# EAGLE design nrfled (EAGLE 6.4)
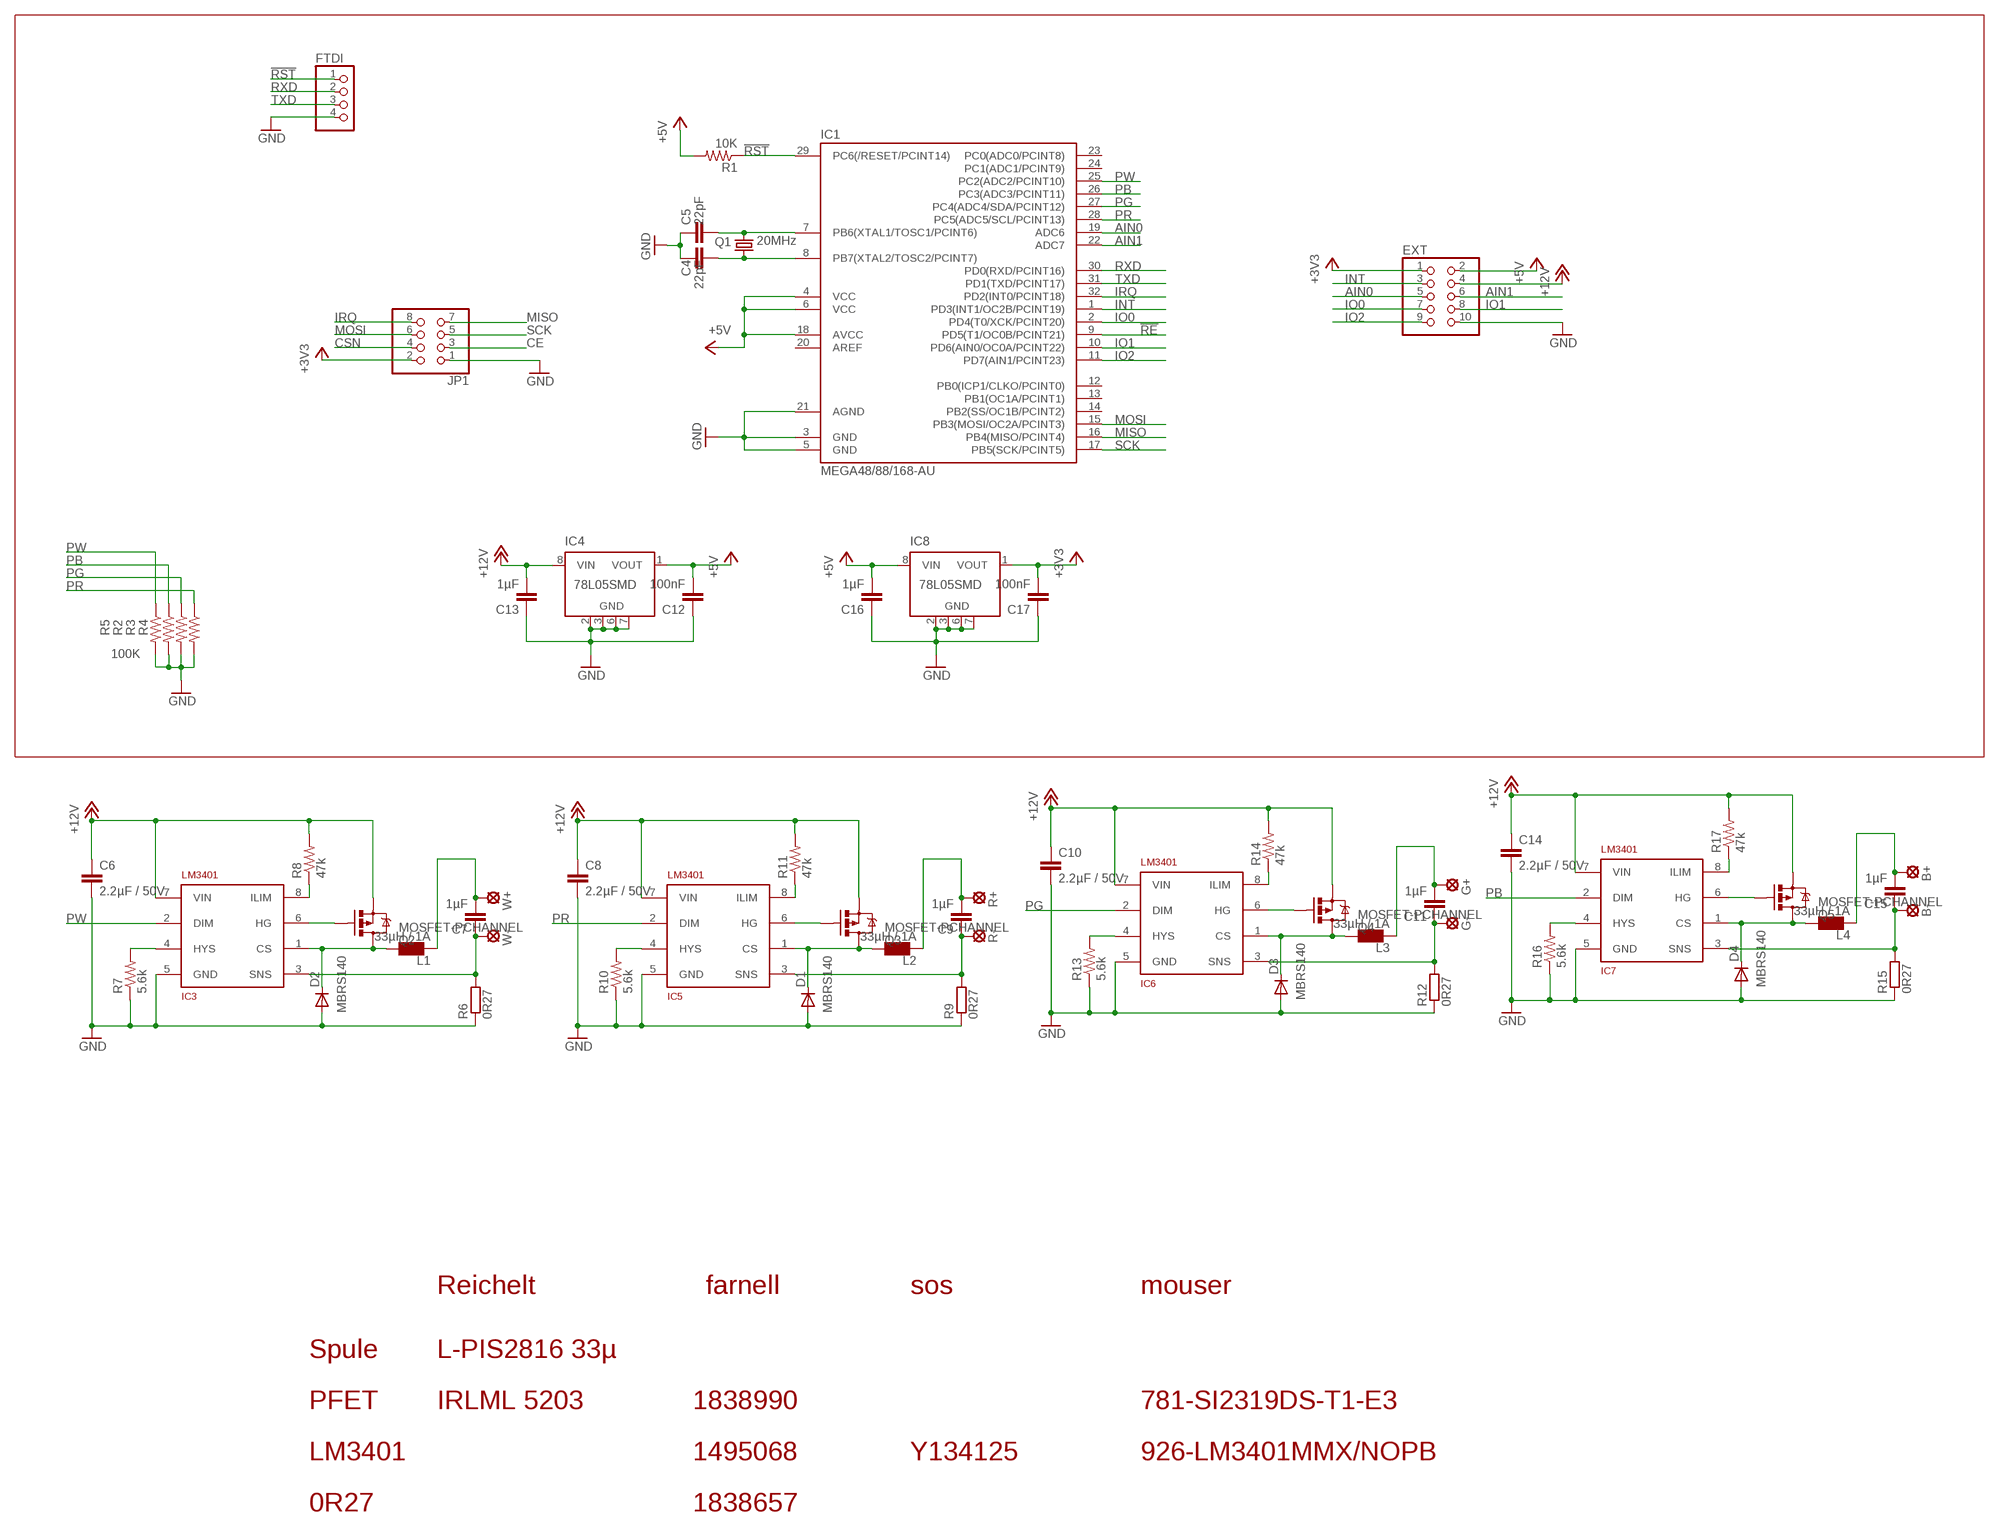
[diagram p0: schematic, sheet 1]

## Parts
B+  SE14  [SE14]
B-  SE14  [SE14]
C4  22pF  CAP0402-CAP  [0402-CAP]
C5  22pF  CAP0402-CAP  [0402-CAP]
C6  2.2µF / 50V  C-EUC1210  [C1210]
C7  1µF  CAP0805  [0805]
C8  2.2µF / 50V  C-EUC1210  [C1210]
C9  1µF  CAP0805  [0805]
C10  2.2µF / 50V  C-EUC1210  [C1210]
C11  1µF  CAP0805  [0805]
C12  100nF  CAP0402-CAP  [0402-CAP]
C13  1µF  CAP0805  [0805]
C14  2.2µF / 50V  C-EUC1210  [C1210]
C15  1µF  CAP0805  [0805]
C16  1µF  CAP0805  [0805]
C17  100nF  CAP0402-CAP  [0402-CAP]
D1  MBRS140  DIODE-SMB  [SMB]
D2  MBRS140  DIODE-SMB  [SMB]
D3  MBRS140  DIODE-SMB  [SMB]
D4  MBRS140  DIODE-SMB  [SMB]
EXT  PINHD-2X5  [2X05]
FTDI  PINHD-1X4  [1X04]
G+  SE14  [SE14]
G-  SE14  [SE14]
IC1  MEGA48/88/168-AU  [TQFP32-08]
IC3  LM3401  [MSOP8]
IC4  78L05SMD  [SO08]
IC5  LM3401  [MSOP8]
IC6  LM3401  [MSOP8]
IC7  LM3401  [MSOP8]
IC8  78L05SMD  [SO08]
JP1  PINHD-2X4  [2X04]
L1  33µH / 1A  L_PIS2816  [PIS2816]
L2  33µH / 1A  L_PIS2816  [PIS2816]
L3  33µH / 1A  L_PIS2816  [PIS2816]
L4  33µH / 1A  L_PIS2816  [PIS2816]
Q1  20MHz  X22-OSCILLATOR  [X22]
Q2  MOSFET-PCHANNEL  [SOT23]
Q3  MOSFET-PCHANNEL  [SOT23]
Q4  MOSFET-PCHANNEL  [SOT23]
Q5  MOSFET-PCHANNEL  [SOT23]
R1  10K  RESISTOR0402-RES  [0402-RES]
R2  100K  RESISTOR0402-RES  [0402-RES]
R3  100K  RESISTOR0402-RES  [0402-RES]
R4  100K  RESISTOR0402-RES  [0402-RES]
R5  100K  RESISTOR0402-RES  [0402-RES]
R6  0R27  R-EU_R1206  [R1206]
R7  5.6k  RESISTOR0805-RES  [0805]
R8  47k  RESISTOR0805-RES  [0805]
R9  0R27  R-EU_R1206  [R1206]
R10  5.6k  RESISTOR0805-RES  [0805]
R11  47k  RESISTOR0805-RES  [0805]
R12  0R27  R-EU_R1206  [R1206]
R13  5.6k  RESISTOR0805-RES  [0805]
R14  47k  RESISTOR0805-RES  [0805]
R15  0R27  R-EU_R1206  [R1206]
R16  5.6k  RESISTOR0805-RES  [0805]
R17  47k  RESISTOR0805-RES  [0805]
R+  SE14  [SE14]
R-  SE14  [SE14]
W+  SE14  [SE14]
W-  SE14  [SE14]

## Nets
!RE: IC1.9(PD5(T1/OC0B/PCINT21))
!RST: FTDI.1 IC1.29(PC6(/RESET/PCINT14)) R1.1
+3V3: C17.2 EXT.1 IC8.1(VOUT) JP1.2
+5V: C12.2 C16.2 EXT.2 IC1.4(VCC) IC1.6(VCC) IC1.18(AVCC) IC4.1(VOUT) IC8.8(VIN) R1.2
+12V: C6.1 C8.1 C10.1 C13.2 C14.1 EXT.4 IC3.7(VIN) IC4.8(VIN) IC5.7(VIN) IC6.7(VIN) IC7.7(VIN) Q2.2(S) Q3.2(S) Q4.2(S) Q5.2(S) R8.2 R11.2 R14.2 R17.2
AIN0: EXT.5 IC1.19(ADC6)
AIN1: EXT.6 IC1.22(ADC7)
CE: JP1.3
CSN: JP1.4
GND: C4.1 C5.1 C6.2 C8.2 C10.2 C12.1 C13.1 C14.2 C16.1 C17.1 D1.A D2.A D3.A D4.A EXT.10 FTDI.4 IC1.3(GND) IC1.5(GND) IC1.21(AGND) IC3.5(GND) IC4.2(GND) IC4.3(GND) IC4.6(GND) IC4.7(GND) IC5.5(GND) IC6.5(GND) IC7.5(GND) IC8.2(GND) IC8.3(GND) IC8.6(GND) IC8.7(GND) JP1.1 R2.2 R3.2 R4.2 R5.2 R6.1 R7.1 R9.1 R10.1 R12.1 R13.1 R15.1 R16.1
INT: EXT.3 IC1.1(PD3(INT1/OC2B/PCINT19))
IO0: EXT.7 IC1.2(PD4(T0/XCK/PCINT20))
IO1: EXT.8 IC1.10(PD6(AIN0/OC0A/PCINT22))
IO2: EXT.9 IC1.11(PD7(AIN1/PCINT23))
IRQ: IC1.32(PD2(INT0/PCINT18)) JP1.8
MISO: IC1.16(PB4(MISO/PCINT4)) JP1.7
MOSI: IC1.15(PB3(MOSI/OC2A/PCINT3)) JP1.6
N$1: C7.1 IC3.3(SNS) R6.2 W-.MP
N$2: C7.2 L1.P$2 W+.MP
N$3: D2.C IC3.1(CS) L1.P$1 Q2.3(D)
N$4: C9.1 IC5.3(SNS) R9.2 R-.MP
N$5: IC3.4(HYS) R7.2
N$6: C9.2 L2.P$2 R+.MP
N$7: IC3.8(ILIM) R8.1
N$8: D1.C IC5.1(CS) L2.P$1 Q3.3(D)
N$9: IC5.4(HYS) R10.2
N$10: IC3.6(HG) Q2.1(G)
N$11: IC5.8(ILIM) R11.1
N$12: IC5.6(HG) Q3.1(G)
N$13: C11.1 G-.MP IC6.3(SNS) R12.2
N$14: C11.2 G+.MP L3.P$2
N$15: D3.C IC6.1(CS) L3.P$1 Q4.3(D)
N$16: IC6.4(HYS) R13.2
N$17: IC6.8(ILIM) R14.1
N$20: IC6.6(HG) Q4.1(G)
N$21: B-.MP C15.1 IC7.3(SNS) R15.2
N$22: B+.MP C15.2 L4.P$2
N$23: D4.C IC7.1(CS) L4.P$1 Q5.3(D)
N$24: IC7.4(HYS) R16.2
N$25: IC7.8(ILIM) R17.1
N$26: IC7.6(HG) Q5.1(G)
PB: IC1.26(PC3(ADC3/PCINT11)) IC7.2(DIM) R2.1
PG: IC1.27(PC4(ADC4/SDA/PCINT12)) IC6.2(DIM) R3.1
PR: IC1.28(PC5(ADC5/SCL/PCINT13)) IC5.2(DIM) R4.1
PW: IC1.25(PC2(ADC2/PCINT10)) IC3.2(DIM) R5.1
RXD: FTDI.2 IC1.30(PD0(RXD/PCINT16))
SCK: IC1.17(PB5(SCK/PCINT5)) JP1.5
TXD: FTDI.3 IC1.31(PD1(TXD/PCINT17))
XTAL1: C5.2 IC1.7(PB6(XTAL1/TOSC1/PCINT6)) Q1.3
XTAL2: C4.2 IC1.8(PB7(XTAL2/TOSC2/PCINT7)) Q1.1
Unconnected: IC1.12(PB0(ICP1/CLKO/PCINT0)) IC1.13(PB1(OC1A/PCINT1)) IC1.14(PB2(SS/OC1B/PCINT2)) IC1.20(AREF) IC1.23(PC0(ADC0/PCINT8)) IC1.24(PC1(ADC1/PCINT9)) IC4.4(NC) IC4.5(NC) IC8.4(NC) IC8.5(NC)

## Notes on the sheet
- Reichelt | farnell | sos | mouser
- Spule | L-PIS2816 33µ
- PFET | IRLML 5203 | 1838990 | 781-SI2319DS-T1-E3
- LM3401 | 1495068 | Y134125 | 926-LM3401MMX/NOPB
- 0R27 | 1838657

## Library data of the parts
B+ B- G+ G- R+ R- W+ W- = solpad:SE14: SOLDER PAD E1553, drill 1,4mm, distributor Buerklin, 07F820
C4 C5 C7 C9 C11-C13 C15-C17 = SparkFun:CAP: Capacitor Standard 0603 ceramic capacitor, and 0.1" leaded capacitor.
C6 C8 C10 C14 = rcl:C-EU: CAPACITOR, European symbol
D1-D4 = diode:DIODE-: DIODE
EXT = pinhead:PINHD-2X5: PIN HEADER
FTDI = pinhead:PINHD-1X4: PIN HEADER
IC1 = avr-7:MEGA48/88/168
IC3 IC5-IC7 = seb:LM3401
IC4 IC8 = linear:78L*SMD: Positive VOLTAGE REGULATOR
JP1 = pinhead:PINHD-2X4: PIN HEADER
L1-L4 = seb:L_PIS2816
Q1 = seb:X22-OSCILLATOR
Q2-Q5 = SparkFun:MOSFET-PCHANNEL
R1-R5 R7 R8 R10 R11 R13 R14 R16 R17 = SparkFun:RESISTOR: Resistor Basic schematic elements and footprints for 0603, 1206, and PTH resistors.
R6 R9 R12 R15 = rcl:R-EU_: RESISTOR, European symbol

## Net classes
2 GND/3V3: width 0.2 mm, drill 0.4 mm

## Board
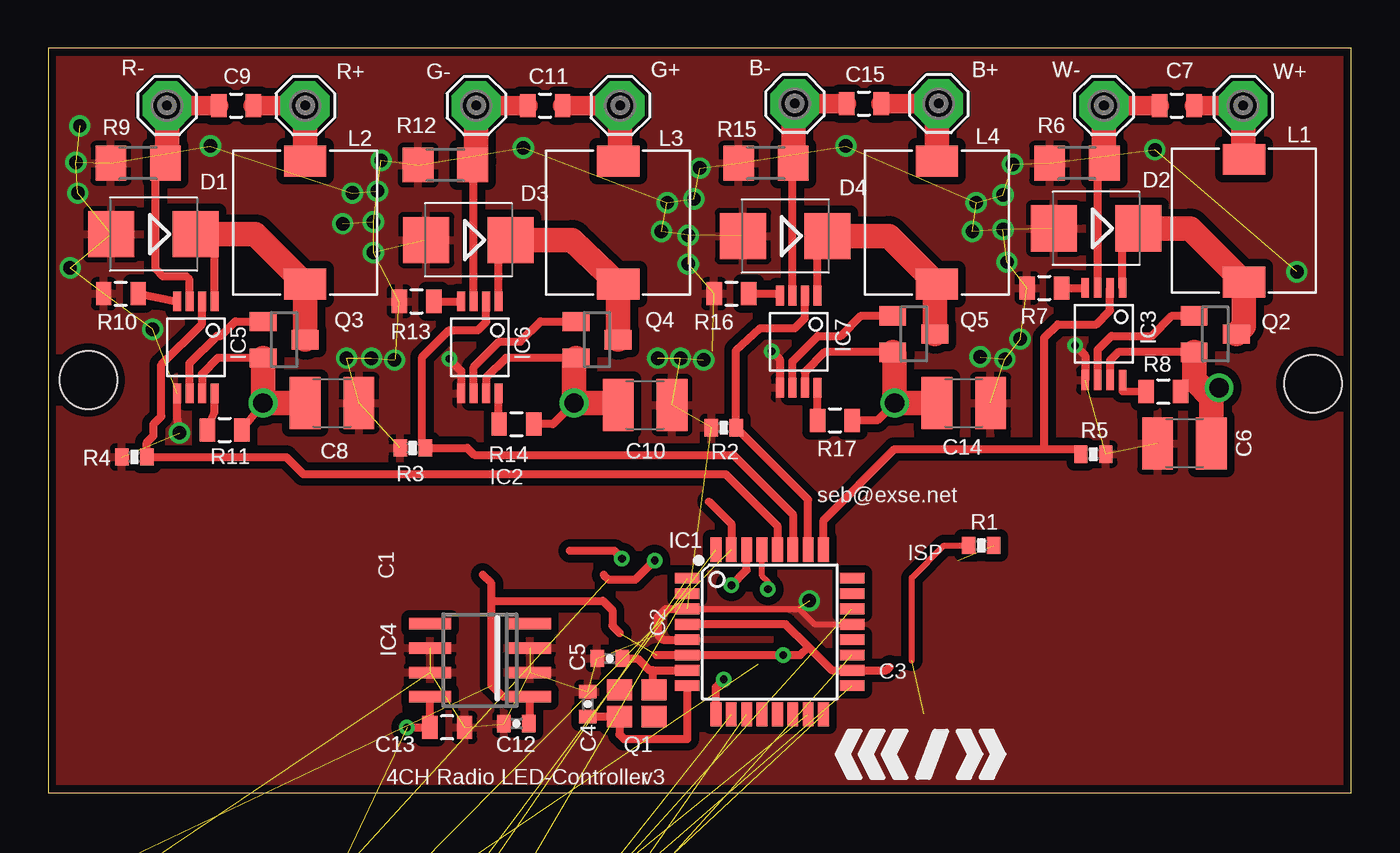
[diagram p1: board, top side]
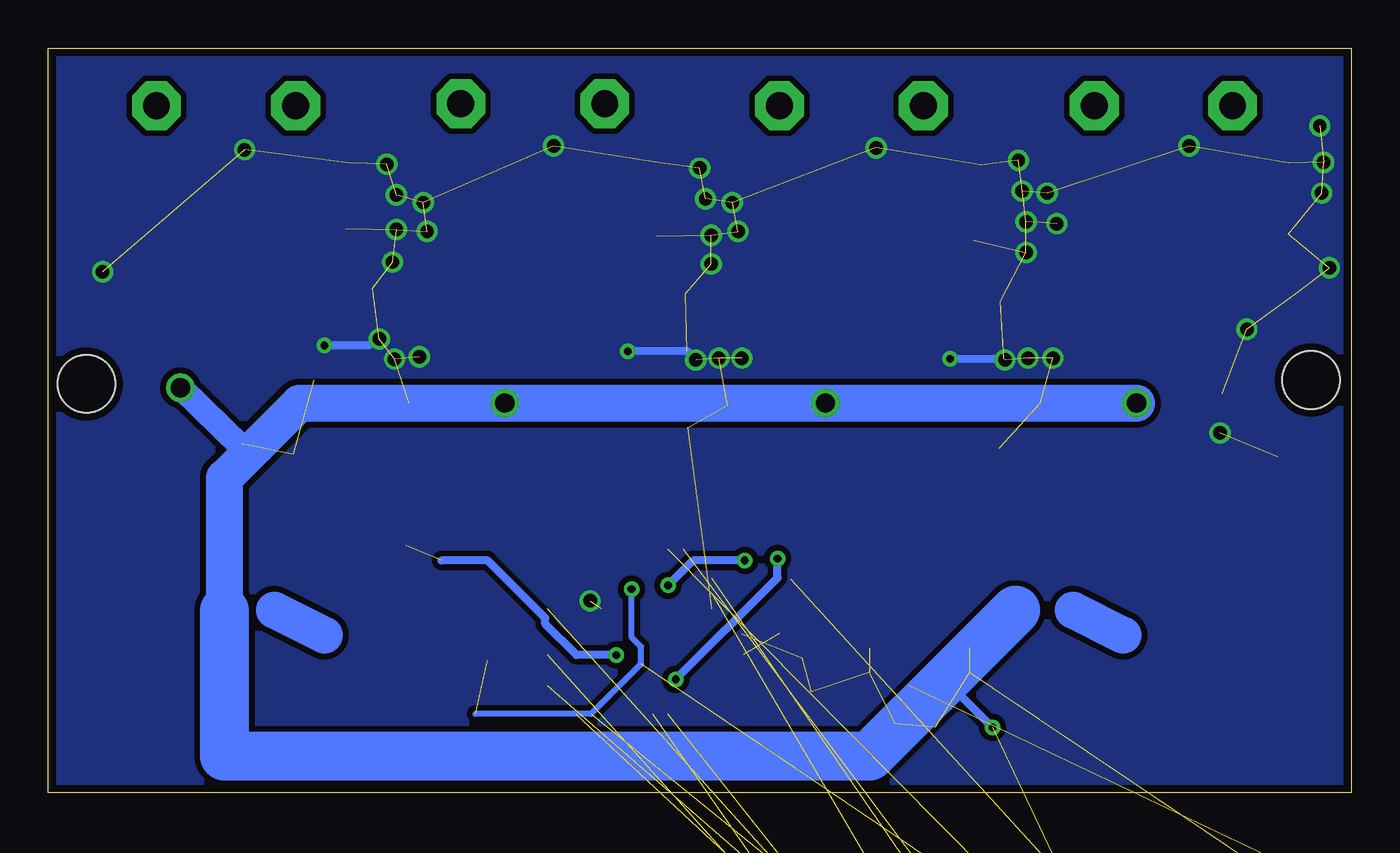
[diagram p2: board, bottom side, seen from below]

Size 67.9 x 38.8 mm. Coordinates in mm from the lower left corner, seen from the top.
Outline: 0,0 67.9,0 67.9,38.8 0,38.8 0,0
Copper layers (1*16): Top 0.035mm / dielectric 1.5mm / Bottom 0.035mm
Design rules "default *": minimum track width 0.2mm, minimum drill 0.5mm, track to track 0.2mm, track to pad 0.2mm, pad to pad 0.2mm, via to via 0.2mm, smd to smd 0mil, copper to edge 0.4mm, drill to drill 8mil, minimum pad ring 0.3mm, minimum via ring 8mil, stop-mask expansion 4mil, vias tented up to drill 40mil, thermal gap 10mil
Holes 3 mm at 2.1,21.5 65.9,21.3

### Footprints (pad centres in the part's own frame; a part is rotated, then mirrored left to right if it is on the bottom)
SE14 = drill 1.397 pad 2.54 octagon: MP 0,0
0402-CAP = smd 0.7 x 0.9: 1 -0.65,0; 2 0.65,0
C1210 = smd 1.6 x 2.7: 1 -1.4,0; 2 1.4,0
0805 = smd 0.8 x 1.2: 1 -0.9,0; 2 0.9,0
SMB = smd 2.4 x 2.4: A 2.2,0; C -2.2,0
2X05 = drill 1.016 octagon: 1 -5.08,-1.27; 2 -5.08,1.27; 3 -2.54,-1.27; 4 -2.54,1.27; 5 0,-1.27; 6 0,1.27; 7 2.54,-1.27; 8 2.54,1.27; 9 5.08,-1.27; 10 5.08,1.27
1X04 = drill 1.016 long: 1 -3.81,0; 2 -1.27,0; 3 1.27,0; 4 3.81,0
TQFP32-08 = smd 1.27 x 0.559: 1 -4.293,2.8; 2 -4.293,2; 3 -4.293,1.2; 4 -4.293,0.4; 5 -4.293,-0.4; 6 -4.293,-1.2; 7 -4.293,-2; 8 -4.293,-2.8; 17 4.293,-2.8; 18 4.293,-2; 19 4.293,-1.2; 20 4.293,-0.4; 21 4.293,0.4; 22 4.293,1.2; 23 4.293,2; 24 4.293,2.8 | smd 0.559 x 1.27: 9 -2.8,-4.293; 10 -2,-4.293; 11 -1.2,-4.293; 12 -0.4,-4.293; 13 0.4,-4.293; 14 1.2,-4.293; 15 2,-4.293; 16 2.8,-4.293; 25 2.8,4.293; 26 2,4.293; 27 1.2,4.293; 28 0.4,4.293; 29 -0.4,4.293; 30 -1.2,4.293; 31 -2,4.293; 32 -2.8,4.293
MSOP8 = smd 0.41 x 1.02: 1 -0.975,-2.4; 2 -0.325,-2.4; 3 0.325,-2.4; 4 0.975,-2.4; 5 0.975,2.4; 6 0.325,2.4; 7 -0.325,2.4; 8 -0.975,2.4
SO08 = smd 0.6 x 2.2: 1 -1.905,-2.6; 2 -0.635,-2.6; 3 0.635,-2.6; 4 1.905,-2.6; 5 1.905,2.6; 6 0.635,2.6; 7 -0.635,2.6; 8 -1.905,2.6
2X04 = drill 1.016 octagon: 1 -3.81,-1.27; 2 -3.81,1.27; 3 -1.27,-1.27; 4 -1.27,1.27; 5 1.27,-1.27; 6 1.27,1.27; 7 3.81,-1.27; 8 3.81,1.27
PIS2816 = smd 2.2 x 1.6: P$1 0,3.2; P$2 0,-3.2
X22 = smd 1.3 x 1.1: 1 0.9,0.7; 2 -0.9,0.7; 3 -0.9,-0.7; 4 0.9,-0.7
SOT23 = smd 1 x 1.4: 1 -0.95,-1.1; 2 0.95,-1.1; 3 0,1.1
0402-RES = smd 0.7 x 0.9: 1 -0.65,0; 2 0.65,0
R1206 = smd 1.6 x 1.803: 1 -1.422,0; 2 1.422,0

### Placement (x,y rotation side)
B+  46.4,35.9 0 top
B-  38.9,35.9 0 top
C4  28.12,4.61 270 top
C5  29.26,6.99 0 top
C6  59.2,18.2 180 top
C7  58.8,35.8 0 top
C8  14.8,20.3 0 top
C9  9.8,35.8 0 top
C10  31.1,20.2 0 top
C11  25.9,35.8 0 top
C12  24.4,3.6 0 top
C13  20.8,3.4 180 top
C14  47.7,20.3 0 top
C15  42.5,35.9 0 top
C16  -0.7,-13.1 0 top  (outside the outline)
C17  2.3,-13 0 top  (outside the outline)
D1  5.5,29.1 180 top
D2  54.6,29.4 180 top
D3  21.9,28.8 180 top
D4  38.4,29 180 top
EXT  4.6,-33.1 0 top  (outside the outline)
FTDI  3.4,-18.6 0 top  (outside the outline)
G+  29.8,35.8 0 top
G-  22.3,35.8 0 top
IC1  37.59,8.37 0 top
IC3  55,23.9 180 top
IC4  22.5,6.9 90 top
IC5  7.7,23.2 180 top
IC6  22.5,23.2 180 top
IC7  39.1,23.5 180 top
IC8  2.1,-7.9 0 top  (outside the outline)
JP1  3.3,-25.6 0 top  (outside the outline)
L1  62.3,29.8 180 top
L2  13.4,29.7 180 top
L3  29.7,29.7 180 top
L4  46.3,29.7 180 top
Q1  30.67,4.66 180 top
Q2  60.8,23.9 270 top
Q3  12.3,23.6 270 top
Q4  28.6,23.6 270 top
Q5  45.1,23.9 270 top
R1  48.61,12.88 0 top
R2  35.2,19.02 180 top
R3  19,17.96 180 top
R4  4.5,17.49 180 top
R5  54.45,17.63 0 top
R6  53.6,32.8 0 top
R7  51.9,26.3 0 top
R8  58.1,20.9 0 top
R9  4.7,32.8 0 top
R10  3.8,26 0 top
R11  9.2,18.9 0 top
R12  20.7,32.7 0 top
R13  19.2,25.6 0 top
R14  24.4,19.2 0 top
R15  37.4,32.8 0 top
R16  35.6,26 0 top
R17  41,19.4 0 top
R+  13.4,35.8 0 top
R-  6.2,35.8 0 top
W+  62.25,35.8 0 top
W-  55,35.8 0 top

### Tracks (layer width: path | path; a pad name or v marks a point on that pad's centre or on a via)
!RE  (via drill 0.4)
  Top 0.406: 34.8,4 IC1.9 34.8,5.5 v35.2,5.9 | 27.19,12.6 29.5,12.6 v29.9,12.2
  Bottom 0.406: v29.9,12.2 29.9,11.2 v35.2,5.9
!RST  (via drill 0.4)  (2 unrouted)
  Top 0.305: IC1.29 37.2,11.3 37.5,11 v37.5,10.6 | 45,6.88 45,11.2 46.68,12.88 R1.1
  Bottom 0.305: v37.5,10.6 37.5,8.1 37,7.6 37,6.7 39.6,4.1 45.63,4.1
+3V3  (3 unrouted)
+5V  (via drill 0.4)  (5 unrouted)
  Top 0.305: 49.25,12.87 R1.2
  Top 0.406: 39.6,7.6 38.43,8.77 IC1.4 | 39.6,7.6 40.83,6.37 IC1.18 43.67,6.37 43.85,6.55 | 39.6,7.6 39.17,7.17 v38.3,7.17 IC1.6 31.69,7.17 | C12.2 25.1,3.55 IC4.1 23.7,5 23.1,5.6 23.1,10 | 23.1,10 23.1,10.9 22.64,11.36 | 23.1,10 28.9,10 29.4,9.5 29.4,8.7 29.79,8.31
  Bottom 0.406: v38.3,7.17 40.37,7.17 42,8.8 42,9.1 45,12.1 47.4,12.1
+12V  (via drill 0.4, 1)  (1 unrouted)
  Top 0.406: IC5.7 8.03,21.82 8.85,22.65 Q3.2 | IC6.7 22.82,21.62 23.85,22.65 Q4.2 | IC7.7 39.42,21.93 40.45,22.95 Q5.2 | IC3.7 55.33,22.52 55.75,22.95 Q2.2 | R17.2 43.2,19.4 v44.1,20.3 | R14.2 26.3,19.2 v27.4,20.3 | v11.2,20.3 R11.2 | IC4.8 C13.2 v18.7,3.4
  Top 0.61: R8.2 59.7,21.6 59.7,21.8
  Top 1.27: C8.1 v11.2,20.3 Q3.2 | C10.1 29.6,20.3 v27.4,20.3 27.4,22.55 Q4.2 | C14.1 v44.1,20.3 44.1,22.85 Q5.2 | 60.6,20.6 C6.1 | 60.6,20.6 59.7,21.5 59.7,21.8 Q2.2 | 60.6,20.6 61,21 v61,21.1
  Bottom 0.406: v18.7,3.4 20.55,5.25 21.75,5.25
  Bottom 1.27: v61,21.1 57.85,18.05 57.05,18.05
  Bottom 1.93: v11.2,20.3 v27.4,20.3 v44.1,20.3 54.8,20.3 57.05,18.05 58.7,16.4 58.7,9.49
  Bottom 2.54: 17.5,9.5 21.75,5.25 25.1,1.9 58.7,1.9 58.7,9.49
AIN0  (1 unrouted)
AIN1  (1 unrouted)
GND  (via drill 0.4, 0.7)  (76 unrouted)
  Top 0.305: IC1.21 39.93,8.77 39.1,9.6 39.07,9.57 IC1.3
  Top 0.406: IC1.5 32.03,7.97 31.75,8.25 31.75,9.14 32.19,9.57 IC1.3 | IC5.5 6.72,19.57 v6.85,18.74 | IC3.5 54.02,22.77 v53.5,23.3 | IC7.5 38.12,22.57 v37.7,23 | IC6.5 21.52,21.98 v20.9,22.6
  Bottom 0.406: v53.5,23.3 51.2,23.3 v50.64,23.64 | v37.7,23 34.61,23 v34.15,22.54 | v20.9,22.6 18.11,22.6 v18.05,22.54
  other vias: 57.66,33.5 39.66,10 49.85,22.59 48.56,22.71 32.95,22.64 31.75,22.64 15.55,22.64 16.85,22.64 16.95,28.14 16.95,29.74 17.15,31.34 17.35,32.94 1.15,27.34 1.55,31.24 1.45,32.84 1.65,34.74 49.95,27.64 49.75,29.34 49.75,31.14 50.25,32.74 33.35,27.54 33.35,29.04 33.65,30.94 33.95,32.54 15.35,29.64 15.85,31.24 31.95,29.24 32.25,30.74 48.15,29.24 48.35,30.74 65.05,27.14 41.56,33.7 24.76,33.6 8.46,33.7 5.45,24.14
  pour Bottom (isolate 0.305, rank 2): 0.04,38.78 0.1,0 67.89,0 67.88,38.78
  pour Top (isolate 0.406, rank 2): 0.01,38.75 0,0 67.82,0 67.88,38.78
INT  (1 unrouted)
IO0  (1 unrouted)
IO1  (1 unrouted)
IO2  (1 unrouted)
IRQ  (1 unrouted)
MISO  (1 unrouted)
MOSI  (1 unrouted)
N$1
  Top 0.406: IC3.3 54.67,32.35 R6.2
  Top 1.016: W-.MP C7.1
  Top 1.27: W-.MP 55,32.82 R6.2
N$2
  Top 1.016: W+.MP C7.2
  Top 1.27: W+.MP 62.25,33.05 L1.P$2
N$3
  Top 0.406: IC3.1 55.98,28.68 D2.C
  Top 1.27: D2.C 59.5,29.4 L1.P$1 62.3,24.3 Q2.3
N$4
  Top 0.406: 5.88,32.55 R9.2 5.6,32.28 5.6,27.3 6,26.9 7.2,26.9 7.38,26.73 IC5.3
  Top 1.016: R-.MP C9.1
  Top 1.27: R9.2 6.2,32.88 R-.MP
N$5
  Top 0.406: R7.2 IC3.4
N$6
  Top 1.016: R+.MP C9.2
  Top 1.27: L2.P$2 R+.MP
N$7
  Top 0.406: IC3.8 55.98,20.93 R8.1
N$8
  Top 0.406: IC5.1 8.68,28.68 D1.C
  Top 1.27: D1.C 10.8,29.1 L2.P$1 Q3.3
N$9
  Top 0.406: R10.2 IC5.4
N$10
  Top 0.406: IC3.6 54.67,23.07 55.4,23.8 57.5,23.8 58.55,24.85 Q2.1
N$11
  Top 0.406: IC5.8 8.68,19.82 R11.1
N$12
  Top 0.406: IC5.6 7.38,22.38 8.8,23.8 9,23.8 9.75,24.55 Q3.1
N$13
  Top 0.406: IC6.3 22.18,32.25 R12.2
  Top 1.016: G-.MP C11.1
  Top 1.27: R12.2 22.3,32.88 G-.MP
N$14
  Top 1.016: G+.MP C11.2
  Top 1.27: L3.P$2 29.8,32.9 G+.MP
N$15
  Top 0.406: IC6.1 23.48,28.27 D3.C
  Top 1.27: D3.C 27.3,28.8 L3.P$1 Q4.3
N$16
  Top 0.406: R13.2 IC6.4
N$17
  Top 0.406: IC6.8 23.48,19.23 R14.1
N$20
  Top 0.406: IC6.6 22.18,22.18 23.5,23.5 24.6,23.5 25.65,24.55 Q4.1
N$21
  Top 0.406: IC7.3 38.77,32.05 R15.2
  Top 1.016: B-.MP C15.1
  Top 1.27: B-.MP 38.82,35.82 R15.2
N$22
  Top 1.016: B+.MP C15.2
  Top 1.27: B+.MP 46.3,35.8 L4.P$2
N$23
  Top 0.406: IC7.1 40.08,28.38 D4.C
  Top 1.27: D4.C 43.8,29 L4.P$1 46.2,26.4 Q5.3
N$24
  Top 0.406: R16.2 37.92,26 IC7.4
N$25
  Top 0.406: IC7.8 40.08,19.43 R17.1
N$26
  Top 0.406: IC7.6 38.77,22.48 40.1,23.8 41.3,23.8 42.35,24.85 Q5.1
N$27
  Bottom 1.93: 11.9,8.2 14.5,9.5
N$28
  Bottom 1.93: 53.5,8.2 56.1,9.5
PB
  Top 0.406: IC1.26 39.59,15.27 R2.1 35.85,23.05 37.1,24.2 38.9,24.2 39.42,24.73 IC7.2
PG
  Top 0.406: IC1.27 38.8,14.51 35.7,17.6 22.2,17.6 21.84,17.96 R3.1 19.5,18.11 19.5,22.7 20.9,24.1 22.4,24.1 22.82,24.52 IC6.2
PR
  Top 0.406: IC5.2 8.03,24.43 5.9,22.3 5.9,19.6 5.5,19.2 5.5,18.6 5.15,18.25 R4.1 12.41,17.49 13.3,16.6 35.3,16.6 37.99,13.9 IC1.28
PW
  Top 0.406: IC3.2 55.33,25.12 54.6,24.4 52.6,24.4 51.9,23.7 51.9,17.9 | 51.9,17.9 44.1,17.9 40.4,14.2 IC1.25 | R5.1 53.54,17.9 51.9,17.9
RXD  (via drill 0.4)  (1 unrouted)
  Top 0.406: v35.6,10.8 36.4,11.6 IC1.30 | 28.94,11.36 29.2,11.1 30.6,11.1 v31.6,12.1
  Bottom 0.406: v31.6,12.1 34.3,12.1 v35.6,10.8
SCK  (1 unrouted)
TXD  (1 unrouted)
  Top 0.406: IC1.31 35.59,14.01 34.43,15.17
XTAL1
  Top 0.406: 31.5,6.37 31.33,6.37 30.71,6.99 C5.2 | 31.5,6.37 IC1.7 | Q1.3 31.5,5.23 31.5,6.37
XTAL2
  Top 0.406: Q1.1 29.84,3.69 | IC1.8 33.3,2.8 30,2.8 29.77,3.03 Q1.1 | Q1.1 C4.2

### Text on the board
tPlace: seb@exse.net | 4CH Radio LED-Controller | v3
_tNames: R- | C9 | R+ | G- | C11 | G+ | B- | C15 | B+ | W- | C7 | W+ | L1 | R9 | L2 | R12 | L3 | R15 | L4 | R6 | D1 | D3 | D4 | D2 | IC7 | IC3 | R10 | IC5 | Q3 | R13 | IC6 | Q4 | R16 | Q5 | R7 | Q2 | R8 | R5 | R17 | C14 | R4 | R11 | C8 | R14 | C10 | R2 | C6 | R3 | IC2 | R1 | IC1 | ISP | C1 | C2 | IC4 | C3 | C5 | Q1 | C13 | C12 | C4
_tValues: SE14 | SE14 | SE14 | SE14 | SE14 | SE14 | SE14 | SE14 | 33µH / 1A | 33µH / 1A | 1µF | 33µH / 1A | 33µH / 1A | 1µF | 1µF | 1µF | MBRS140 | MBRS140 | MBRS140 | MBRS140 | 0R27 | 0R27 | 0R27 | 0R27 | LM3401 | LM3401 | 5.6k | LM3401 | MOSFET-PCHANNEL | LM3401 | MOSFET-PCHANNEL | 5.6k | MOSFET-PCHANNEL | 5.6k | MOSFET-PCHANNEL | 5.6k | 2.2µF / 50V | 47k | 47k | 47k | 47k | 2.2µF / 50V | 2.2µF / 50V | 2.2µF / 50V | RJ45-8L-B | 100K | 78L05SMD | MEGA48/88/168-AU | 1µF | RJ45-8L-B | 100nF